# EasyEDA Pro project ProPrj_tl494紫外灯（复活赛）_2025-11-29.epro

# Schematic Schematic1
Board Name: Board1; Create Date: 2025-10-18; Page Name: P1; Project Name: tl494紫外灯（复活赛）; Schematic Name: Schematic1; Update Date: 2025-11-12; Company: 嘉立创EDA; Page Size: A4; Version: V1.0
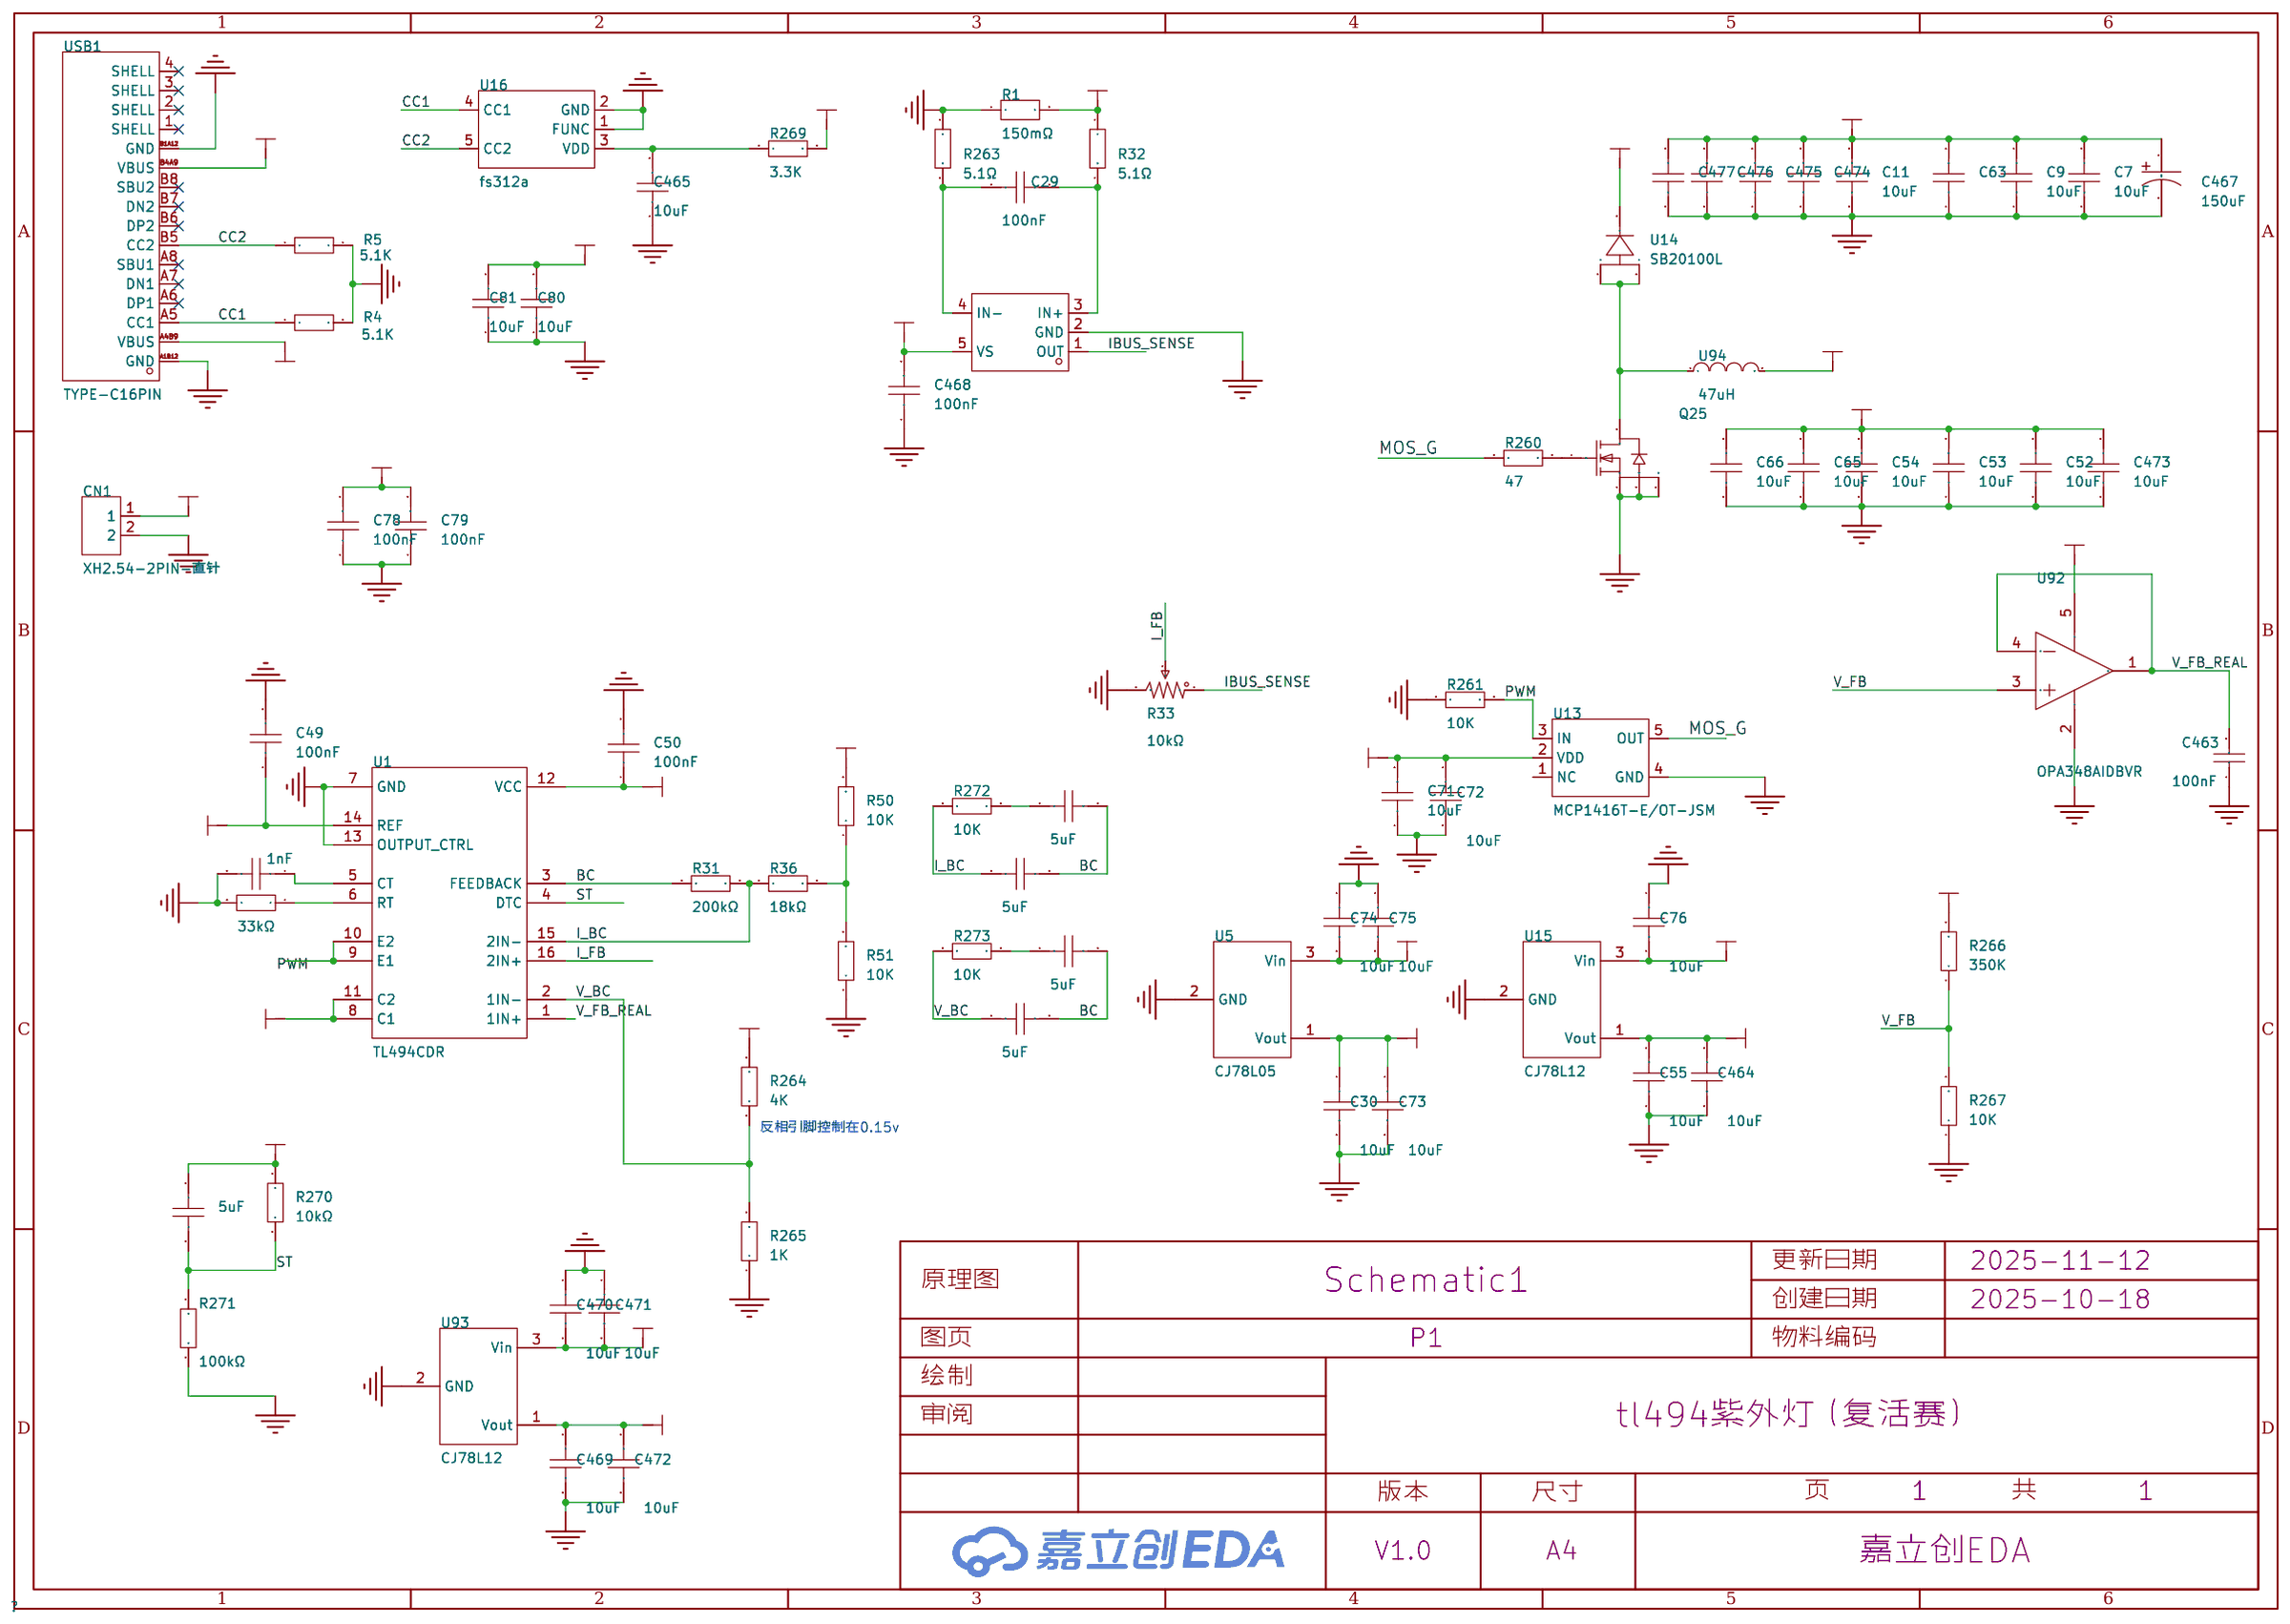
[diagram p0: schematic sheet]

## Parts
C7  10uF  [C1210]
C9  10uF  [C1210]
C11  10uF  [C1210]
C20  1nF  [C0603]
C29  100nF  [C0402_s]
C30  10uF  [C0603]
C49  100nF  [C0603]
C50  100nF  [C0603]
C52  10uF  [C1210]
C53  10uF  [C1210]
C54  10uF  [C1210]
C55  10uF  [C0603]
C63  10uF  [C1210]
C65  10uF  [C1210]
C66  10uF  [C1210]
C70  5uF  [C0603]
C71  10uF  [C0603]
C72  10uF  [C0603]
C73  10uF  [C0603]
C74  10uF  [C0603]
C75  10uF  [C0603]
C76  10uF  [C0603]
C78  100nF  [C0603]
C79  100nF  [C0603]
C80  10uF  [C1210]
C81  10uF  [C1210]
C463  100nF  [C0402_NEW]
C464  10uF  [C0603]
C465  10uF  [C1210]
C467  150uF  [CAP-TH_BD10.0-P5.00-D1.0-FD]
C468  100nF  [C0603]
C469  10uF  [C0603]
C470  10uF  [C0603]
C471  10uF  [C0603]
C472  10uF  [C0603]
C473  10uF  [C1210]
C474  10uF  [C1210]
C475  10uF  [C1210]
C476  10uF  [C1210]
C477  10uF  [C1210]
C478  5uF  [C0603]
C479  5uF  [C0603]
C480  5uF  [C0603]
C481  5uF  [C0603]
CN1  XH2.54-2PIN-直针  [CONN-TH_XH2.54-2P]
Q25  CSD18540Q5B(TOKMAS)  [TDSON-8_L5.9-W5.2-P1.27-BL]
R1  150mΩ  [R2512]
R4  5.1K  [R0603]
R5  5.1K  [R0603]
R23  33kΩ  [R0603]
R31  200kΩ  [R0603]
R32  5.1Ω  [R0603]
R33  10kΩ  [RES-ADJ-TH_3P-L10.0-W10.0-P2.50-L]
R36  18kΩ  [R0603]
R50  10K  [R0603]
R51  10K  [R0603]
R260  47  [R0805]
R261  10K  [R0603]
R263  5.1Ω  [R0603]
R264  4K  [R0603]
R265  1K  [R0603]
R266  350K  [R0603]
R267  10K  [R0603]
R269  3.3K  [R0603]
R270  10kΩ  [R0603]
R271  100kΩ  [R0603]
R272  10K  [R0603]
R273  10K  [R0603]
U1  TL494CDR  [SOIC-16_L9.9-W3.9-P1.27-LS6.0-BL]
U4  null  [SOT-23-5_L3.0-W1.7-P0.95-LS2.8-BR]
U5  CJ78L05  [SOT-89-3_L4.5-W2.5-P1.50-LS4.2-BR]
U13  MCP1416T-E/OT-JSM  [SOT-23-5_L3.0-W1.6-P0.95-LS2.8-BR]
U14  SB20100L  [TO-277_3P-L5.4-W4.0-LS6.5-BR]
U15  CJ78L12  [SOT-89-3_L4.5-W2.5-P1.50-LS4.2-BR]
U16  fs312a  [SOT-23-5_L3.0-W1.7-P0.95-LS2.8-BL]
U92  OPA348AIDBVR  [SOT-23-5_L3.0-W1.7-P0.95-LS2.8-BR]
U93  CJ78L12  [SOT-89-3_L4.5-W2.5-P1.50-LS4.2-BR]
U94  47uH  [IND-TH_L21.5-W10.0_XR065125T]
USB1  TYPE-C16PIN  [USB-C-SMD_TYPE-C16PIN]

## Library data of the parts
C7 C9 C11 C52-C54 C63 C65 C66 C80 C81 C465 C473-C477 = FS32X106K101EGG: 容值:10uF;精度:±10%;额定电压:100V;温度系数:X7R;; LCSC Part Name: 10uF ±10% 100V; Supplier Part: C5156756; Manufacturer: PSA(信昌电陶); Supplier Footprint: 1210; JLCPCB Part Class: 扩展库; Datasheet: https://atta.szlcsc.com/upload/public/pdf/source/20220906/2A42A90825742552985FFB5A7BAB200E.pdf; Supplier: LCSC; Tolerance: ±10%; Voltage Rating: 100V; Temperature Coefficient: X7R
C20 C70 C478-C481 = CAP_0603: Supplier Footprint: 0603
C29 C30 C55 C71-C76 C464 C469-C472 = CL05B104KB54PNC: 容值:100nF;精度:±10%;额定电压:50V;材质(温度系数):X7R;; LCSC Part Name: 100nF ±10% 50V; Supplier Part: C307331; Manufacturer: SAMSUNG(三星); Supplier Footprint: 0402; JLCPCB Part Class: 基础库; Datasheet: https://atta.szlcsc.com/upload/public/pdf/source/20181009/C307331_222F7C870FD3EA5F46F538B483443886.pdf; Supplier: LCSC; Tolerance: ±10%; Voltage Rated: 50V; Temperature Coefficient: X7R
C49 C50 C78 C79 C468 = FM31X224K201EEG: 容值:220nF;精度:±10%;额定电压:200V;材质(温度系数):X7R;; LCSC Part Name: 220nF ±10% 200V; Supplier Part: C2847454; Manufacturer: PSA(信昌电陶); Supplier Footprint: 1206; JLCPCB Part Class: 扩展库; Datasheet: https://atta.szlcsc.com/upload/public/pdf/source/20210721/C2847454_D00BC27086C5022173E0F870A9D97A67.pdf; Supplier: LCSC; Tolerance: ±10%; Voltage Rated: 200V; Temperature Coefficient: X7R
C463 = CL05B104KO5NNNC: 容值:100nF;精度:±10%;额定电压:16V;材质(温度系数):X7R;; LCSC Part Name: 100nF ±10% 16V; Supplier Part: C1525; Manufacturer: SAMSUNG(三星); Supplier Footprint: 0402; JLCPCB Part Class: 基础库; Datasheet: https://atta.szlcsc.com/upload/public/pdf/source/20160103/1457707674891.pdf; Supplier: LCSC; Tolerance: ±10%; Voltage Rated: 16V; Temperature Coefficient: X7R
C467 = LKME2002A151MF: 容值:150uF;精度:±20%;额定电压:100V;纹波电流:-;等效串联电阻(ESR):-;; LCSC Part Name: 150uF ±20% 100V; Supplier Part: C443142; Manufacturer: Ymin(永铭); Supplier Footprint: 插件,D10xL20mm; JLCPCB Part Class: 扩展库; Supplier: LCSC; Tolerance: ±20%; Voltage Rating: 100V; Pin Spacing: 5mm; Diameter: 10mm; Height - Seated (Max): 20mm; Lifetime: 10000hrs@105℃
CN1 = XH2.54-2PIN-直针: Supplier Part: C9900011425; Supplier Footprint: XH2.54-2PIN; JLCPCB Part Class: 扩展库; Supplier: LCSC
Q25 = CSD18540Q5B(TOKMAS): 类型:1个N沟道;漏源电压(Vdss):60V;连续漏极电流(Id):200A;导通电阻(RDS(on)@Vgs,Id):2.3mΩ;功率(Pd):132W;; LCSC Part Name: 1个N沟道 耐压:60V 电流:200A; Supplier Part: C19626234; Manufacturer: Tokmas(托克马斯); Supplier Footprint: DFN-8(5x6); JLCPCB Part Class: 扩展库; Datasheet: https://atta.szlcsc.com/upload/public/pdf/source/20231208/6906E27DFF30F6153115656ACF0DBA8B.pdf; Supplier: LCSC; Type: 1个N沟道; Drain Source Voltage (Vdss): 60V; Continuous Drain Current (Id): 200A; Drain Source On Resistance (RDS(on)@Vgs,Id): 2.3mΩ; Power Dissipation (Pd): 132W
R1 = RE2512F3R150: 电阻类型:采样电阻;阻值:150mΩ;精度:±1%;功率:3W;温度系数:±50ppm/℃;; LCSC Part Name: 150mΩ 3W 2512 ±1%; Supplier Part: C46961761; Manufacturer: 捷而瑞; Supplier Footprint: 2512; JLCPCB Part Class: 扩展库; Datasheet: https://atta.szlcsc.com/upload/public/pdf/source/20250325/401775B85EF7B3A580BC34DFED100CB2.pdf; Supplier: LCSC; Type: 采样电阻; Tolerance: ±1%; Power(Watts): 3W; Temperature Coefficient: ±50ppm/℃
R4 R5 R50 R51 R260 R261 R264-R267 R272 R273 = Res_0603: Supplier Footprint: 0603
R23 R31 R36 R270 R271 = Res_AXIAL-1/8W: Supplier Footprint: 轴向引线
R32 R263 R269 = 0603WAF510KT5E: 电阻类型:厚膜电阻;阻值:5.1Ω;精度:±1%;功率:100mW;; LCSC Part Name: 5.1Ω ±1% 100mW; Supplier Part: C25197; Manufacturer: UNI-ROYAL(厚声); Supplier Footprint: 0603; JLCPCB Part Class: 基础库; Datasheet: https://atta.szlcsc.com/upload/public/pdf/source/20200306/C422600_1E6D84923E4A46A82E41ADD87F860B5C.pdf; Supplier: LCSC; Type: 厚膜电阻; Tolerance: ±1%; Power(Watts): 100mW; Temperature Coefficient: ±200ppm/℃; Overload Voltage (Max): 75V; Operating Temperature Range: -55℃~+155℃
R33 = 3296W-1-103: 阻值:10kΩ;精度:±10%;; LCSC Part Name: 10kΩ ±10%; Supplier Part: C118954; Manufacturer: BOCHEN(博晨); Supplier Footprint: 插件; JLCPCB Part Class: 扩展库; Datasheet: https://atta.szlcsc.com/upload/public/pdf/source/20171114/C118954_15106326646611117443.pdf; Supplier: LCSC; Tolerance: ±10%
U1 = TL494CDR: 功能类型:降压型；升压型；升降压型;输入电压:7V~40V;; Supplier Part: C19882; Manufacturer: TI(德州仪器); Supplier Footprint: SOIC-16-150mil; JLCPCB Part Class: 扩展库; Datasheet: https://www.ti.com/cn/lit/gpn/tl494; Supplier: LCSC; Function: 降压型；升压型；升降压型; Input Voltage: 7V~40V; Switching Frequency: 300kHz; Operating Temperature: 0℃~+70℃@(TA); Synchronous Rectification: 否; Number of Outputs: 2; Topology: 全桥式；降压式；推挽式；正激式；反激式；升压式；半桥式; Switch tube (built-in/external): 外置
U4 = INA180A2IDBVT: 通道数:1;; Supplier Part: C116203; Manufacturer: TI(德州仪器); Supplier Footprint: SOT-23-5; JLCPCB Part Class: 扩展库; Datasheet: https://www.ti.com/cn/lit/gpn/ina180; Supplier: LCSC; Number of Channels: 1; Supply Current: 260uA; Operating Temperature: -40℃~+125℃
U5 U15 U93 = CJ78L05_C2079: 输出类型:固定;工作电压:30V;输出电压:5V;输出电流:100mA;输出极性:正极;; LCSC Part Name: 输入30V 输出5V 100mA; Supplier Part: C2079; Manufacturer: CJ(江苏长电/长晶); Supplier Footprint: SOT-89-3L; JLCPCB Part Class: 扩展库; Datasheet: https://atta.szlcsc.com/upload/public/pdf/source/20171228/C164903_15144413069831213906.pdf; Supplier: LCSC; Output Type: 固定; Voltage - Supply: 30V; Output Voltage: 5V; Output Current: 100mA; Voltage Dropout: 1.7V@(40mA); Output Configuration: 正极; Number of Outputs: 1
U13 = MCP1416T-E/OT-JSM: 驱动配置:-;负载类型:MOSFET；IGBT;驱动通道数:-;灌电流(IOL):2A;拉电流(IOH):2A;工作电压:4.5V~25V;上升时间(tr):-;下降时间(tf):30ns;; LCSC Part Name: 2A单通道高速驱动芯片; Supplier Part: C18195002; Manufacturer: JSMSEMI(杰盛微); Supplier Footprint: SOT-23-5; JLCPCB Part Class: 扩展库; Datasheet: https://item.szlcsc.com/datasheet/MCP1416T-E%252FOT-JSM/19344086.html; Supplier: LCSC; Load Type: MOSFET；IGBT; Current - Output Low(IOL): 2A; Current - Output High(IOH): 2A; Voltage - Supply: 4.5V~25V; Fall Time: 30ns; Features: 欠压保护(UVP); Operating Temperature: -40℃~+125℃
U14 = SB20100L_C5807934: 二极管配置:独立式;正向压降(Vf):700mV@20A;直流反向耐压(Vr):100V;整流电流:20A;; LCSC Part Name: 电压:100V 电流:20A; Supplier Part: C5807934; Manufacturer: GOODWORK(固得沃克); Supplier Footprint: TO-277; JLCPCB Part Class: 扩展库; Datasheet: https://item.szlcsc.com/datasheet/SB20100L/6737143.html; Supplier: LCSC; Diode Configuration: 独立式; Voltage - Forward(Vf@If): 700mV@20A; Voltage - DC Reverse(Vr): 100V; Current - Rectified: 20A; Reverse Leakage Current (Ir): 100uA; Non-Repetitive Peak Forward Surge Current: 200A
U16 = fs312a: Supplier Part: C9900044546; Supplier Footprint: SOT23-5; Supplier: LCSC
U92 = OPA348AIDBVR: 放大器数:单路;轨到轨:-;增益带宽积(GBP):1MHz;压摆率(SR):0.5V/us;输入偏置电流(Ib):0.5pA;; Supplier Part: C363280; Manufacturer: TI(德州仪器); Supplier Footprint: SOT-23-5; JLCPCB Part Class: 扩展库; Datasheet: https://www.ti.com/cn/lit/gpn/opa2348; Supplier: LCSC; Number of Circuits: 单路; Gain Bandwidth Product(GBP): 1MHz; Slew Rate(SR): 0.5V/us; Current - Input Bias(Ib): 0.5pA; Output Current: 10mA; Operating Temperature: -40℃~+125℃
U94 = XR065125TS100MV1L: 电感值:10uH;精度:±10%;额定电流:7.8A;类型:磁环电感;; LCSC Part Name: 带热缩套管; Supplier Part: C22358471; Manufacturer: XR(祥如); Supplier Footprint: 插件,20x9mm; JLCPCB Part Class: 扩展库; Datasheet: https://item.szlcsc.com/datasheet/XR065125TS100MV1L/23794810.html; Supplier: LCSC; Tolerance: ±10%; Current Rating: 7.8A; Type: 磁环电感; Wire Diameter: 1mm
USB1 = TYPE-C16PIN: 连接器类型:Type-C;标准:USB 3.1;公母:母;安装方式:卧贴;触点数量:16P;端口数量:1;额定电流 - 电源:3A;工作温度范围:-40℃~+85℃;; LCSC Part Name: Type-C 母 卧贴; Supplier Part: C393939; Manufacturer: SHOU HAN(首韩); Supplier Footprint: SMD; JLCPCB Part Class: 扩展库; Datasheet: https://atta.szlcsc.com/upload/public/pdf/source/20190521/C393939_7B9043D4CF1026AF443AB60D91FBCD5C.pdf; Supplier: LCSC; Connector Type: Type-C; Standard: USB 3.1; Gender: 母; Mounting Style: 卧贴; Number of Contacts: 16P; Number of Ports: 1; Current Rating - Power (Max): 3A; Operating Temperature Range: -40℃~+85℃; Rated Voltage (Max): 30V; Connect-Disconnect Life: 1万次; Core Colour: 黑色

## Nets
+5V: C30.1 C73.1 C468.2 U4.5(VS) U5.1(Vout) U92.5(V+)
GND: C7.1 C9.1 C11.1 C20.2 C30.2 C49.2 C50.2 C52.1 C53.1 C54.1 C55.2 C63.1 C65.1 C66.1 C71.1 C72.2 C73.2 C74.1 C75.1 C76.1 C78.1 C79.1 C80.1 C81.1 C463.1 C464.2 C465.1 C467.2 C468.1 C469.2 C470.1 C471.1 C472.2 C473.1 C474.1 C475.1 C476.1 C477.1 CN1.2 Q25.1(S) Q25.2(S) Q25.3(S) R1.1 R4.2 R5.2 R23.2 R33.3 R51.1 R261.1 R263.1 R265.1 R267.1 R271.2 U1.7(GND) U1.13(OUTPUT CTRL) U4.2(GND) U5.2(GND) U13.4(GND) U15.2(GND) U16.1(FUNC) U16.2(GND) U92.2(V-) U93.2(GND) USB1.A1B12(GND) USB1.B1A12(GND)
GND_LED: R1.2 R32.1
VCC_12V: C55.1 C71.2 C72.1 C464.1 U13.2(VDD) U15.1(Vout)
VCC_12V_0: C78.2 C79.2 C469.1 C472.1 CN1.1 U93.1(Vout)
VCC_20V: C50.1 C52.2 C53.2 C54.2 C65.2 C66.2 C74.2 C75.2 C76.2 C80.2 C81.2 C470.2 C471.2 C473.2 R269.2 U1.12(VCC) U5.3(Vin) U15.3(Vin) U93.3(Vin) U94.2 USB1.A4B9(VBUS) USB1.B4A9(VBUS)
VCC_LED: C7.2 C9.2 C11.2 C63.2 C467.1 C474.2 C475.2 C476.2 C477.2 R266.2 U14.2(A)
BC: C478.2 C479.2 C480.2 C481.2 R31.1 U1.3(FEEDBACK)
CC1: R4.1 U16.4(CC1) USB1.A5(CC1)
CC2: R5.1 U16.5(CC2) USB1.B5(CC2)
I_BC: C478.1 R31.2 R36.1 R272.2 U1.15(2IN-)
I_FB: R33.2 U1.16(2IN+)
IBUS_SENSE: R33.1 U4.1(OUT)
MOS_G: R260.1 U13.5(OUT)
PWM: R261.2 U1.9(E1) U1.10(E2) U13.3(IN)
REF_5V: C49.1 C70.1 R50.2 R264.2 R270.1 U1.8(C1) U1.11(C2) U1.14(REF)
ST: C70.2 R270.2 R271.1 U1.4(DTC)
V_BC: C480.1 R264.1 R265.2 R273.2 U1.2(1IN-)
V_FB: R266.1 R267.2 U92.3(IN+)
V_FB_REAL: C463.2 U1.1(1IN+) U92.1(OUT) U92.4(IN-)
$1N2212: R36.2 R50.1 R51.2
$1N2215: R23.1 U1.6(RT)
$1N2218: C20.1 U1.5(CT)
$1N2952: Q25.4(G) R260.2
$1N3019: Q25.5(D) U14.1(K) U14.3(K) U94.1
$1N3862: C29.2 R32.2 U4.3(IN+)
$1N3872: C29.1 R263.2 U4.4(IN-)
$1N4683: C465.2 R269.1 U16.3(VDD)
$1N15446: C479.1 R272.1
$1N15548: C481.1 R273.1

Not connected (* = marked no-connect by the designer): U13 1(NC); USB1 1(SHELL)* 2(SHELL)* 3(SHELL)* 4(SHELL)* A6(DP1)* A7(DN1)* A8(SBU1)* B6(DP2)* B7(DN2)* B8(SBU2)*

## Notes on the sheet
- 反相引脚控制在0.15v

# Board PCB1
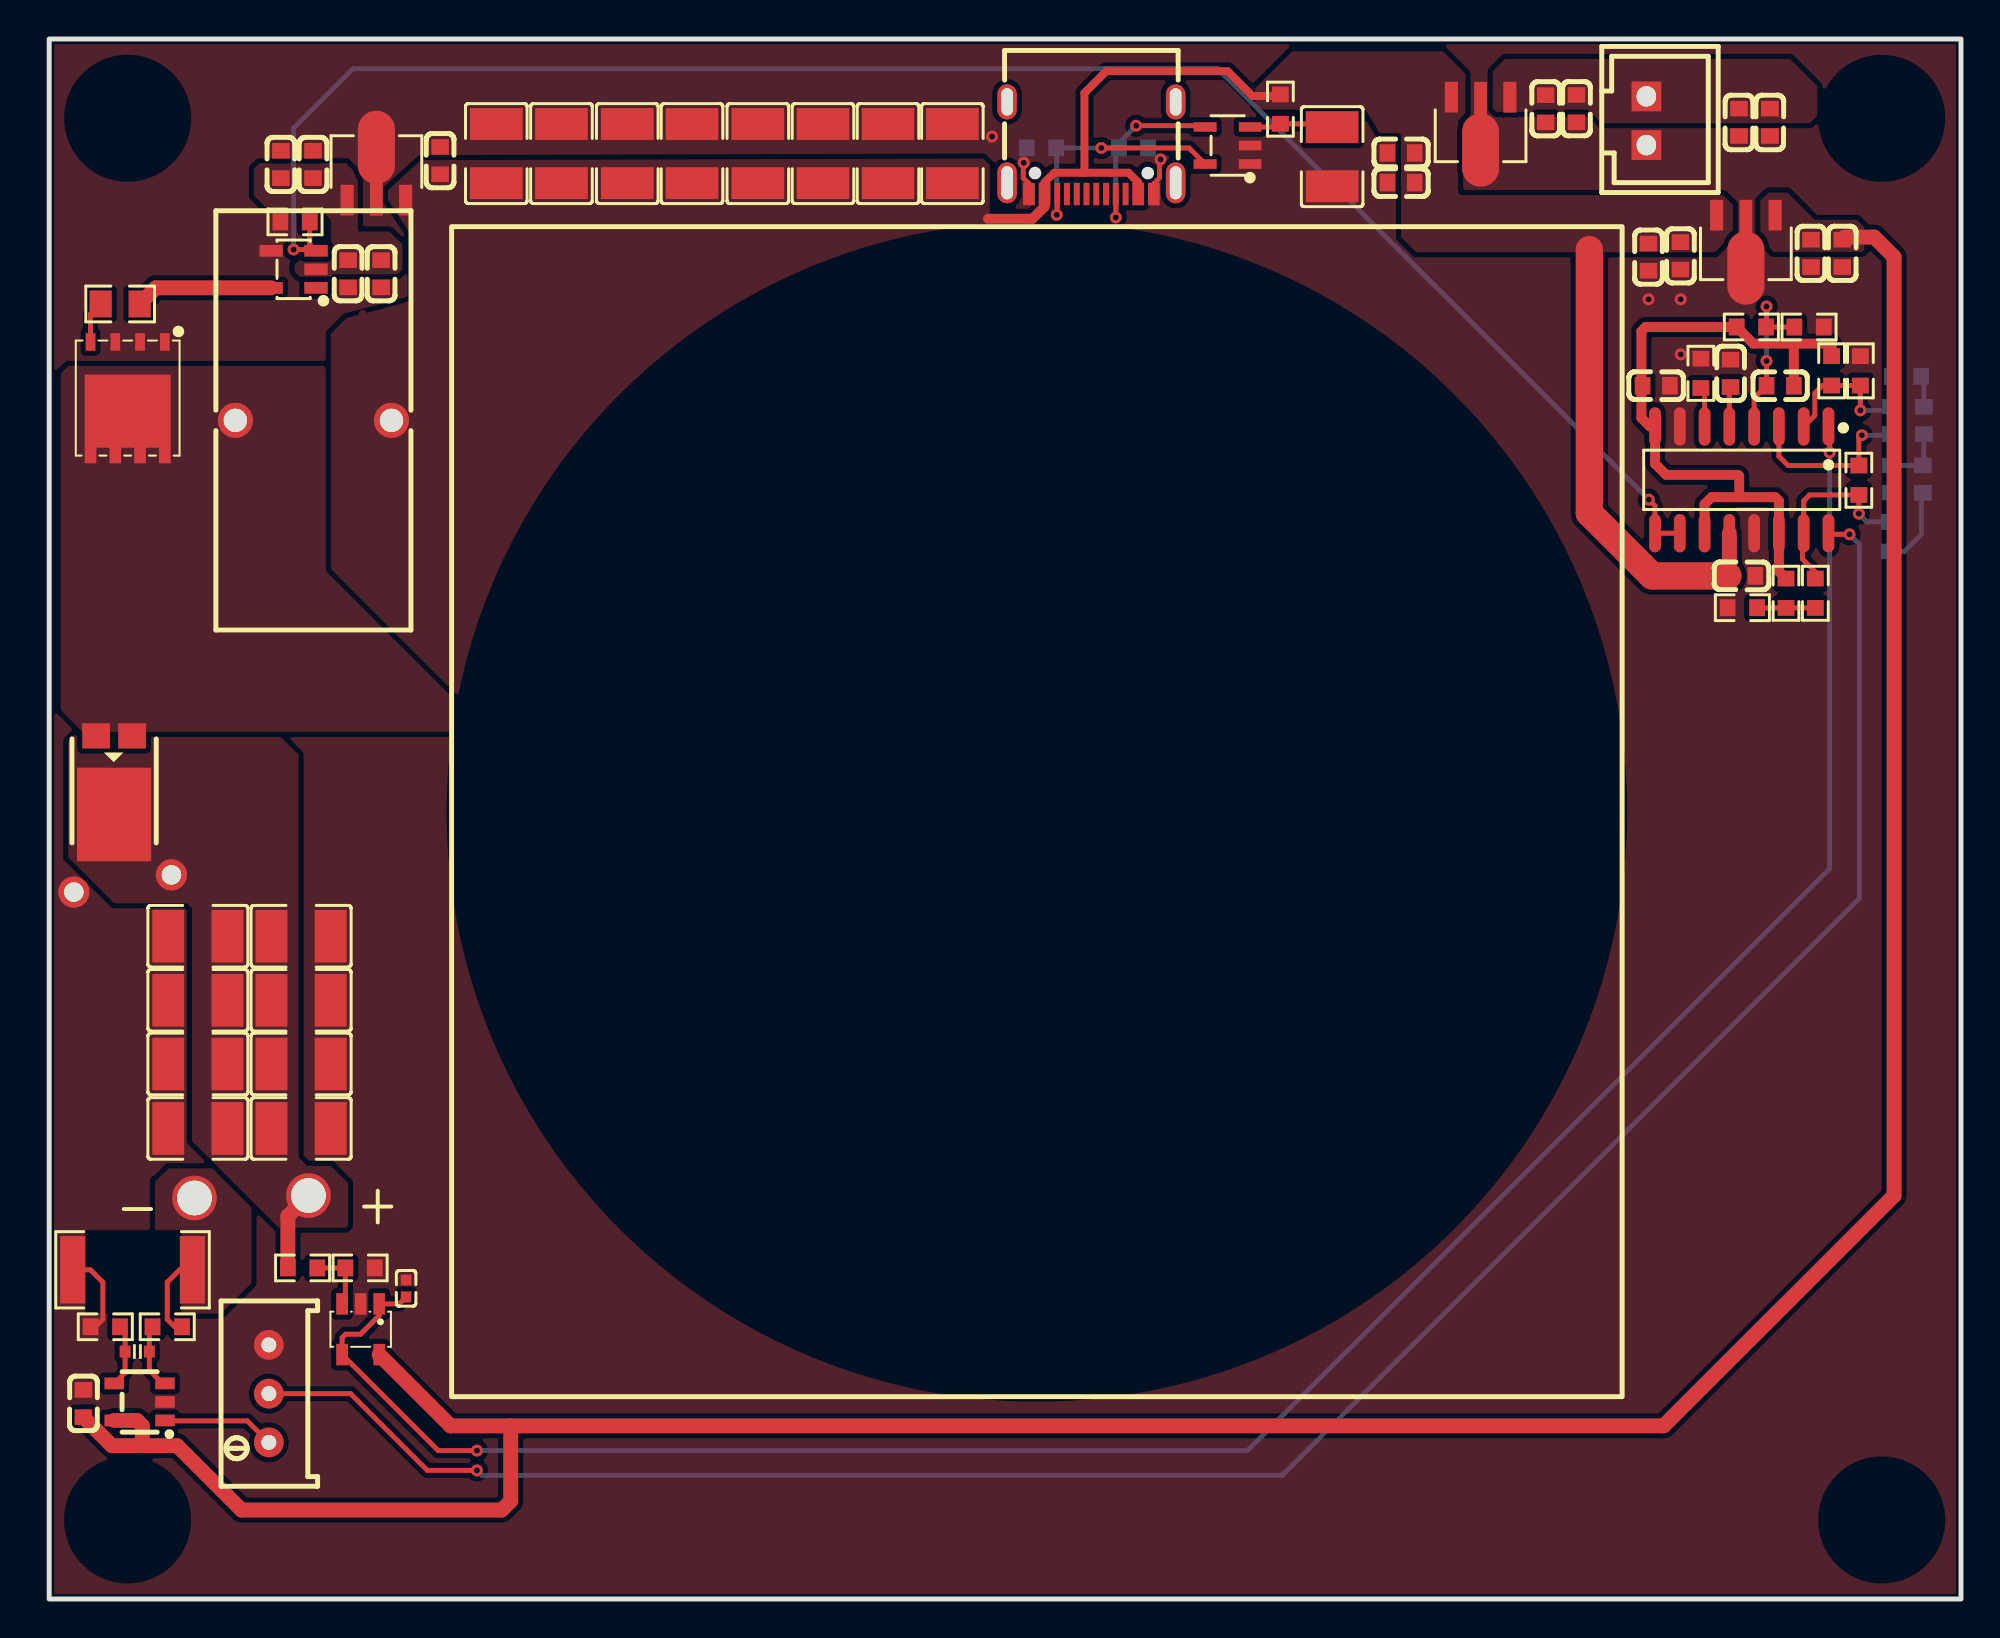
[diagram p1: board, top side]
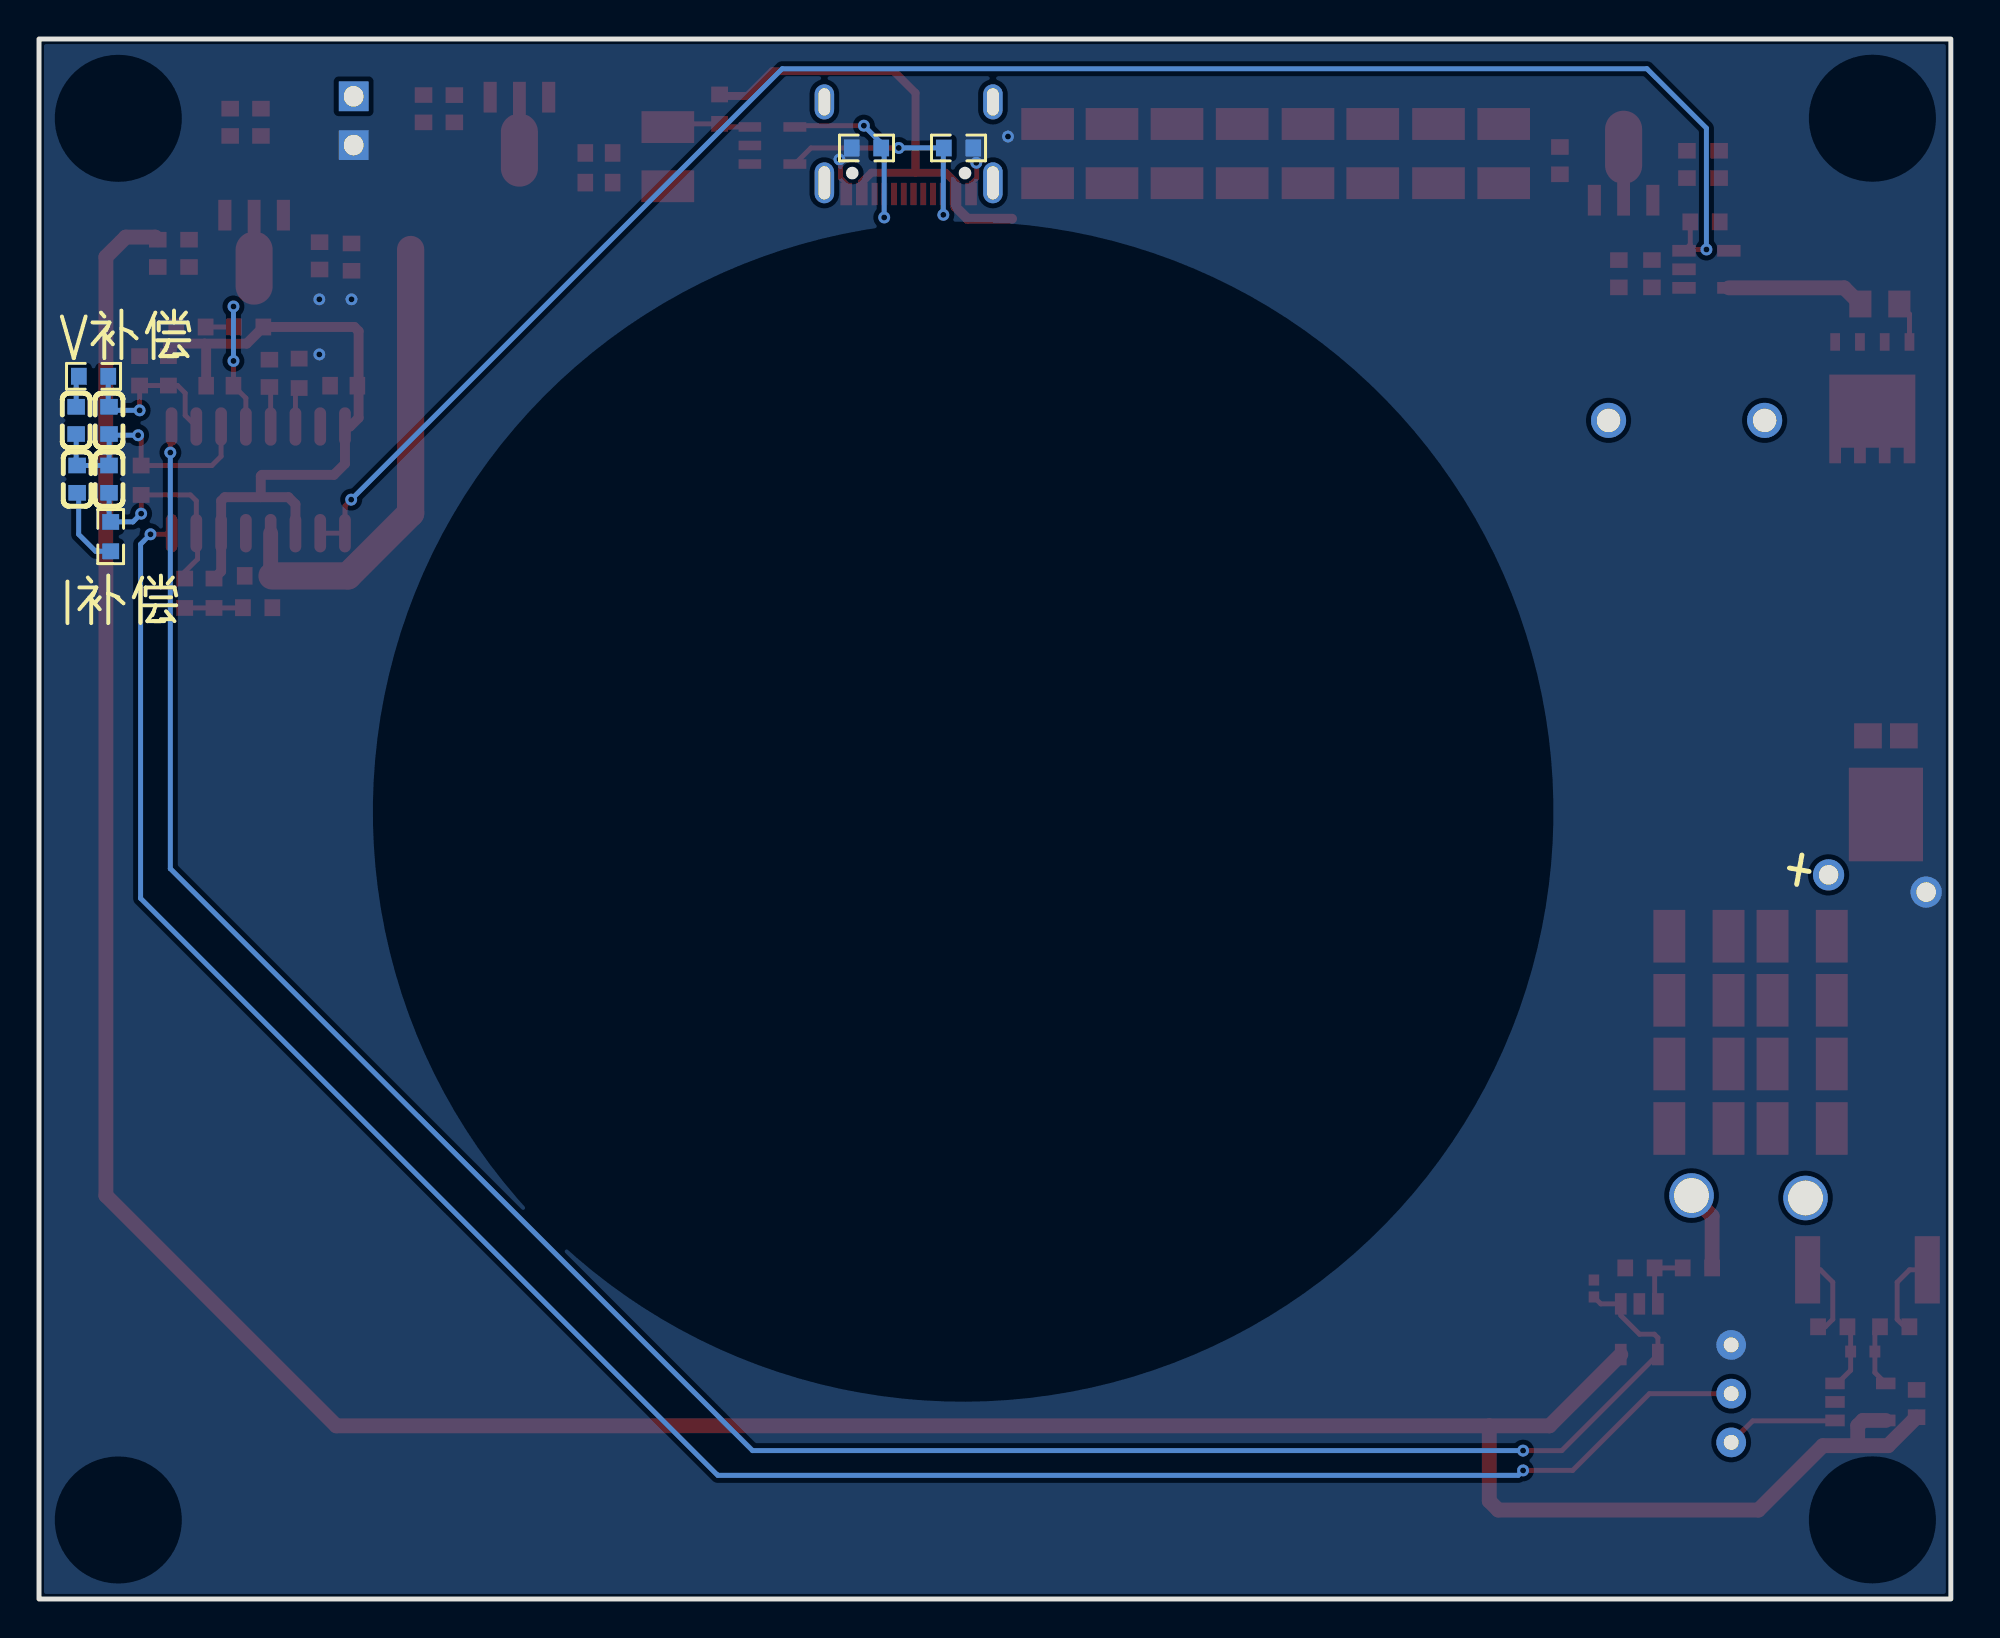
[diagram p2: board, bottom side, seen from below]

Outline 98 x 80 mm; copper layers: Top Layer, Inner1, Inner2, Bottom Layer. Coordinates in mm from the lower left corner of the outline.
Outline path: rectangle 0,80 98,0
Stack: Top Layer 0.035mm 外层铜厚1oz / Dielectric1 0.2104mm 7628 RC49% 8.6mil / Inner1 0.0152mm 内层铜厚 / Dielectric2 1.065mm 1.1mm H/HOZ Copper / Inner2 0.0152mm 内层铜厚 / Dielectric3 0.2104mm 7628 RC49% 8.6mil / Bottom Layer 0.035mm 外层铜厚1oz

## Design rules (mm)
template: 自定义配置
spacing copperThickness1oz (default): track to track 0.102, other pairs 0.152 to 0.3
spacing copperThickness2oz: track to track 0.203, other pairs 0.152 to 0.3
track width copperThickness1oz (default): min 0.127, default 0.254, max 2.54
track width copperThickness2oz: min 0.203, default 0.254, max 2.54
differential pair differentialPair (default): width min 0.127, default 0.254, max 2.54; gap min 0.152, default 0.152
via viaSize (default): diameter min 0.5, default 0.61, max 10; hole min 0.3, default 0.305, max 6.3

## Placement (name value [footprint] x y rotation side)
C7  10uF  [C1210]  7.62 24.13 0 top
C9  10uF  [C1210]  7.62 27.44 0 top
C11  10uF  [C1210]  7.62 33.99 0 top
C20  1nF  [C0603]  86.19 62.85 90 top
C29  100nF  [C0402_s]  4.53 12.69 180 top
C30  10uF  [C0603]  90.31 69.01 270 top
C49  100nF  [C0603]  82.38 62.22 0 top
C50  100nF  [C0603]  86.76 52.47 0 top
C52  10uF  [C1210]  22.92 74.12 270 top
C53  10uF  [C1210]  26.26 74.12 270 top
C54  10uF  [C1210]  29.63 74.12 270 top
C55  10uF  [C0603]  11.88 73.57 90 top
C63  10uF  [C1210]  7.62 30.7 0 top
C65  10uF  [C1210]  36.33 74.12 270 top
C66  10uF  [C1210]  32.95 74.12 270 top
C70  5uF  [C0603]  88.73 62.22 180 top
C71  10uF  [C0603]  17.02 67.96 90 top
C72  10uF  [C0603]  15.32 67.96 270 top
C73  10uF  [C0603]  91.91 69.01 270 top
C74  10uF  [C0603]  83.62 68.88 90 top
C75  10uF  [C0603]  81.98 68.82 90 top
C76  10uF  [C0603]  20.04 73.76 270 top
C78  100nF  [C0603]  88.2 75.73 90 top
C79  100nF  [C0603]  86.62 75.73 90 top
C80  10uF  [C1210]  46.3 74.12 270 top
C81  10uF  [C1210]  43 74.12 270 top
C463  100nF  [C0402_NEW]  18.3 15.93 270 top
C464  10uF  [C0603]  13.52 73.57 90 top
C465  10uF  [C1210]  65.77 73.96 90 top
C467  150uF  [CAP-TH_BD10.0-P5.00-D1.0-FD]  3.77 36.69 190 bottom
C468  100nF  [C0603]  1.75 10.02 270 top
C469  10uF  [C0603]  78.29 76.43 270 top
C470  10uF  [C0603]  69.3 72.63 0 top
C471  10uF  [C0603]  69.3 74.16 0 top
C472  10uF  [C0603]  76.71 76.42 270 top
C473  10uF  [C1210]  39.67 74.12 270 top
C474  10uF  [C1210]  12.91 33.99 180 top
C475  10uF  [C1210]  12.91 30.7 180 top
C476  10uF  [C1210]  12.91 27.44 180 top
C477  10uF  [C1210]  12.91 24.13 180 top
C478  5uF  [C0603]  94.41 57.43 90 bottom
C479  5uF  [C0603]  96.04 57.43 90 bottom
C480  5uF  [C0603]  94.41 60.44 270 bottom
C481  5uF  [C0603]  96.09 60.44 270 bottom
CN1  XH2.54-2PIN-直针  [CONN-TH_XH2.54-2P]  81.87 75.81 270 top
NOREF  -  [Pad_e385]  7.45 20.56 0 top
NOREF#2  -  [Pad_e384]  13.29 20.69 0 top
Q25  CSD18540Q5B(TOKMAS)  [TDSON-8_L5.9-W5.2-P1.27-BL]  4.02 62.69 180 top
R1  150mΩ  [R2512]  4.27 16.88 0 top
R4  5.1K  [R0603]  55.58 74.41 0 bottom
R5  5.1K  [R0603]  50.87 74.41 180 bottom
R23  33kΩ  [R0603]  84.67 62.85 90 top
R31  200kΩ  [R0603]  92.76 57.37 270 top
R32  5.1Ω  [R0603]  6.05 13.96 180 top
R33  10kΩ  [RES-ADJ-TH_3P-L10.0-W10.0-P2.50-L]  11.26 10.53 90 top
R36  18kΩ  [R0603]  90.53 51.58 270 top
R50  10K  [R0603]  89.03 51.58 90 top
R51  10K  [R0603]  86.79 50.84 0 top
R260  47  [R0805]  3.64 66.41 180 top
R261  10K  [R0603]  12.6 70.62 0 top
R263  5.1Ω  [R0603]  2.88 13.96 0 top
R264  4K  [R0603]  91.37 62.98 90 top
R265  1K  [R0603]  92.84 62.98 270 top
R266  350K  [R0603]  12.99 16.98 180 top
R267  10K  [R0603]  15.94 16.98 180 top
R269  3.3K  [R0603]  63.11 76.4 90 top
R270  10kΩ  [R0603]  87.25 65.23 0 top
R271  100kΩ  [R0603]  90.21 65.23 0 top
R272  10K  [R0603]  94.33 54.48 90 bottom
R273  10K  [R0603]  95.2 62.7 180 bottom
U1  TL494CDR  [SOIC-16_L9.9-W3.9-P1.27-LS6.0-BL]  86.76 57.39 180 top
U4  null  [SOT-23-5_L3.0-W1.7-P0.95-LS2.8-BR#2]  4.64 10.11 0 top
U5  CJ78L05  [SOT-89-3_L4.5-W2.5-P1.50-LS4.2-BR]  86.97 69.61 90 top
U13  MCP1416T-E/OT-JSM  [SOT-23-5_L3.0-W1.6-P0.95-LS2.8-BR]  12.53 68.19 0 top
U14  SB20100L  [TO-277_3P-L5.4-W4.0-LS6.5-BR]  3.33 42.25 90 top
U15  CJ78L12  [SOT-89-3_L4.5-W2.5-P1.50-LS4.2-BR]  16.77 73.09 270 top
U16  fs312a  [SOT-23-5_L3.0-W1.7-P0.95-LS2.8-BL]  60.41 74.54 90 top
U92  OPA348AIDBVR  [SOT-23-5_L3.0-W1.7-P0.95-LS2.8-BR]  15.97 13.83 90 top
U93  CJ78L12  [SOT-89-3_L4.5-W2.5-P1.50-LS4.2-BR]  73.37 75.66 90 top
U94  47uH  [IND-TH_L21.5-W10.0_XR065125T]  13.55 60.44 0 top
USB1  TYPE-C16PIN  [USB-C-SMD_TYPE-C16PIN]  53.42 74.41 180 top

## Footprints (pads in the part's own frame, mm; a bottom-side part is the same pattern mirrored in y, then rotated)
C0402_NEW
  rect 0.566x0.54 smd: 1(-0.425,0) 2(0.441,0)
C0402_s
  rect 0.559x0.61 smd: 1(0.635,0) 2(-0.61,0)
C0603
  rect 0.8x0.9 smd: 1(-0.7,0) 2(0.7,0)
C1210
  rect 1.635x2.7 smd: 1(-1.518,0) 2(1.518,0)
CAP-TH_BD10.0-P5.00-D1.0-FD
  round 1.6 hole 1: 1(-2.54,0) 2(2.54,0)
CONN-TH_XH2.54-2P
  rect 1.524x1.524 hole 1.05x1: 1(-1.25,0) 2(1.25,0)
IND-TH_L21.5-W10.0_XR065125T
  round 1.8 hole 1.2: 1(-4,0) 2(4,0)
Pad_e384
  round 2.286 hole 1.778: 2(0,0)
Pad_e385
  round 2.286 hole 1.778: 1(0,0)
R0603
  rect 0.806x0.864 smd: 1(-0.753,0) 2(0.753,0)
R0805
  rect 1.133x1.377 smd: 1(-1,0) 2(1,0)
R2512
  rect 1.282x3.456 smd: 1(-3.067,0) 2(3.067,0)
RES-ADJ-TH_3P-L10.0-W10.0-P2.50-L
  round 1.524 hole 0.762: 1(-2.5,0) 2(0,0) 3(2.5,0)
SOIC-16_L9.9-W3.9-P1.27-LS6.0-BL
  oval 0.602x1.971 smd: 1(-4.445,-2.736) 2(-3.175,-2.736) 3(-1.905,-2.736) 4(-0.635,-2.736) 5(0.635,-2.736) 6(1.905,-2.736) 7(3.175,-2.736) 8(4.445,-2.736) 9(4.445,2.736) 10(3.175,2.736) 11(1.905,2.736) 12(0.635,2.736) 13(-0.635,2.736) 14(-1.905,2.736) 15(-3.175,2.736) 16(-4.445,2.736)
SOT-23-5_L3.0-W1.6-P0.95-LS2.8-BR
  rect 1.2x0.6 smd: 1(1.15,-0.95) 2(1.15,0) 3(1.15,0.95) 4(-1.15,0.95) 5(-1.15,-0.95)
SOT-23-5_L3.0-W1.7-P0.95-LS2.8-BL
  rect 0.49x1.157 smd: 1(-0.95,-1.153) 2(0,-1.153) 3(0.95,-1.153)
  rect 0.49x1.175 smd: 4(0.95,1.153) 5(-0.95,1.153)
SOT-23-5_L3.0-W1.7-P0.95-LS2.8-BR
  rect 1.1x0.6 smd: 1(1.3,-0.95) 2(1.3,0) 3(1.3,0.95) 4(-1.3,0.95) 5(-1.3,-0.95)
SOT-23-5_L3.0-W1.7-P0.95-LS2.8-BR#2
  rect 1x0.6 smd: 1(1.3,-0.95) 2(1.3,0) 3(1.3,0.95) 4(-1.3,0.95) 5(-1.3,-0.95)
SOT-89-3_L4.5-W2.5-P1.50-LS4.2-BR
  rect 1.575x0.672 smd: 1(1.356,-1.5) 3(1.356,1.5)
  custom 5.377x1.9 smd: 2(-1.356,0)
TDSON-8_L5.9-W5.2-P1.27-BL
  rect 0.5x0.9 smd: 1(-1.905,-1.775) 2(-0.635,-1.775) 3(0.635,-1.775) 4(1.905,-1.775)
  custom 4.41x4.55 smd: 5(0,1.775)
TO-277_3P-L5.4-W4.0-LS6.5-BR
  rect 1.29x1.423 smd: 1(2.017,-0.92) 3(2.017,0.92)
  rect 4.8x3.8 smd: 2(-2.017,0)
USB-C-SMD_TYPE-C16PIN
  oval 1x2.1 hole 0.6x1.7: 1(-4.32,1.788) 2(4.32,1.788)
  oval 1x1.8 hole 0.6x1.4: 3(-4.32,-2.362) 4(4.32,-2.362)
  rect 0.6x1.15 smd: A1B12(-3.2,2.362) A4B9(-2.4,2.362) B1A12(3.2,2.362) B4A9(2.4,2.362)
  rect 0.3x1.15 smd: A5(-1.25,2.362) A6(-0.25,2.362) A7(0.25,2.362) A8(1.25,2.362) B5(1.75,2.362) B6(0.75,2.362) B7(-0.75,2.362) B8(-1.75,2.362)

## Nets
As in the schematic, except:
GND_LED: NOREF.1 R1.2 R32.1
VCC_LED: C7.2 C9.2 C11.2 C63.2 C467.1 C474.2 C475.2 C476.2 C477.2 NOREF#2.2 R266.2 U14.2

Pads without a net: U13 1; USB1 1 2 3 4 A6 A7 A8 B6 B7 B8

## Via types
v1: diameter 0.61, hole 0.305, Top Layer to Bottom Layer, 21 vias

## Routing (per net, layer and track width the routed paths; a pad name or vN(x,y) marks a point on that pad's centre or on a via; arc(x,y) is an arc through that point)
+5V: length 165.8
  Top Layer w0.762: C73.1 92.05,69.84 93.55,69.84 94.57,68.82 94.57,20.69 82.76,8.88 23.66,8.88 ; 16.92,12.53 20.57,8.88 23.66,8.88 ; U4.5 4.51,9.16 4.77,8.89 4.77,7.86 ; 23.66,8.88 23.66,5.02 23.2,4.56 9.86,4.56 6.56,7.86 4.77,7.86 ; 4.77,7.86 3.22,7.86 1.75,9.32
GND: length 8.2
  Top Layer w0.254: R1.1 2.11,16.88 2.75,16.25 2.75,14.34 2.37,13.96 R263.1 ; v1(56.97,73.83) 56.92,73.78 56.92,72.87 56.62,72.58 56.62,72.05 ; USB1.B1A12 50.22,72.58 49.93,72.87 49.93,73.62 v1(49.96,73.65)
  vias: v1(48.33,75) v1(81.98,66.65) v1(83.63,66.65) v1(83.63,63.82)
GND_LED: length 4.4
  Top Layer w0.254: R1.2 6.69,16.88 6.05,16.25 6.05,14.34 6.43,13.96 R32.1
VCC_20V: length 49.3
  Top Layer w0.406: 53.07,73.14 51.52,73.14 51.02,72.65 USB1.B4A9 ; 53.07,73.14 55.33,73.14 55.82,72.65 USB1.A4B9 ; 53.07,73.14 53.07,77.23 54.18,78.35 60.41,78.35 61.68,77.08 63.04,77.08 R269.2
  Top Layer w0.508: 48.12,70.78 50.4,70.78 51.02,71.4 USB1.B4A9
  Top Layer w0.762: 86.06,52.69 86.13,52.76 U1.12
  Top Layer w1.397: 78.95,69.2 78.95,55.68 82.17,52.47 C50.1
VCC_LED: length 4.1
  Top Layer w0.762: NOREF#2.2 12.24,19.64 R266.2
BC: length 13.8
  Top Layer w0.254: U1.3 88.67,58.6 89.14,58.13 R31.1 92.76,59.52 v1(92.92,59.68)
  Bottom Layer w0.254: C481.2 96.09,58.18 C479.2 C478.2 C480.2 94.35,59.68 v1(92.92,59.68)
CC1: length 9.9
  Top Layer w0.254: v1(54.68,70.85) 54.68,72.05 USB1.A5 ; U16.4 59.19,75.55 v1(55.72,75.55)
  Bottom Layer w0.254: v1(54.68,70.85) 54.68,74.26 R4.1 54.83,74.67 v1(55.72,75.55)
CC2: length 12.5
  Top Layer w0.254: USB1.B5 51.67,71.01 v1(51.64,70.98) ; v1(53.93,74.41) 58.43,74.41 U16.5
  Bottom Layer w0.254: v1(53.93,74.41) 51.67,74.41 51.64,74.39 ; 51.64,74.39 R5.1 ; 51.64,74.39 v1(51.64,70.98)
I_BC: length 11.5
  Top Layer w0.254: v1(92.76,55.66) R31.2 90.24,56.62 89.94,56.31 U1.15 89.87,54.59 89.87,53.33 90.53,52.67 R36.1
  Bottom Layer w0.254: v1(92.76,55.66) 93.19,55.23 R272.2 94.41,55.32 C478.1
I_FB: length 115.5
  Top Layer w0.254: R33.2 15.45,10.53 19.39,6.59 v1(21.93,6.59) ; U1.16 91.26,54.6 v1(92.28,54.6)
  Bottom Layer w0.254: v1(92.28,54.6) 92.79,54.09 92.79,35.93 63.2,6.34 22.18,6.34 v1(21.93,6.59)
IBUS_SENSE: length 5.8
  Top Layer w0.254: U4.1 5.96,9.13 10.16,9.13 R33.1
MOS_G: length 7.1
  Top Layer w0.762: U13.5 5.47,67.24 R260.1
PWM: length 91.9
  Top Layer w0.254: 13.61,69.2 U13.3 ; 13.61,69.2 13.36,69.46 R261.2 ; 13.61,69.2 v1(12.53,69.2) ; U1.10 U1.9 82.32,56.06 v1(82,56.38)
  Bottom Layer w0.254: v1(82,56.38) 59.9,78.48 15.58,78.48 12.53,75.43 v1(12.53,69.2)
REF_5V: length 35.6
  Top Layer w0.508: 86.63,56.5 85.22,56.5 84.86,56.15 U1.11 ; 86.63,56.5 88.48,56.5 88.67,56.31 U1.14 88.67,52.69 R50.2 ; 86.63,56.5 86.63,57.59 86.57,57.65 82.89,57.65 82.32,58.22 U1.8 82.06,60.13 81.62,60.57 81.62,62.16 C49.1 81.62,62.28 81.62,65.01 81.83,65.23 R270.1 87.35,64.38 89.51,64.38 ; 89.51,64.38 89.43,64.3 C70.1 ; 89.51,64.38 91.37,64.38 91.37,63.74
ST: length 8.9
  Top Layer w0.254: U1.4 87.4,61.58 C70.2 v1(88.03,63.49) ; v1(88.03,66.28) 88.03,65.26 88.01,65.23 89.46,65.23 R271.1
  Bottom Layer w0.254: v1(88.03,63.49) v1(88.03,66.28)
V_BC: length 8.9
  Top Layer w0.254: U1.2 90.51,60.7 90.51,61.84 90.9,62.23 R264.1 R265.2 v1(92.84,60.96)
  Bottom Layer w0.254: v1(92.84,60.96) 94.22,60.96 C480.1 94.45,61.18 94.45,62.7
V_FB: length 3.4
  Top Layer w0.254: U92.3 15.18,15.3 R267.2 R266.1
V_FB_REAL: length 118.7
  Top Layer w0.254: v1(21.93,7.61) 19.94,7.61 U92.4 ; v1(91.27,58.79) 91.27,60.07 U1.1 ; 15.02,12.54 15.02,13.4 15.2,13.58 15.96,13.58 16.92,14.54 16.92,15.13 17.94,15.13 C463.2
  Bottom Layer w0.254: v1(91.27,58.79) 91.27,37.45 61.42,7.61 v1(21.93,7.61)
$1N2212: length 3
  Top Layer w0.254: R51.2 87.56,50.82 R50.1 R36.2
$1N2215: length 2.1
  Top Layer w0.254: R23.1 84.86,61.91 U1.6
$1N2218: length 2.1
  Top Layer w0.254: U1.5 86.13,62.09 C20.1
$1N2952: length 2.2
  Top Layer w0.254: R260.2 2.12,65.89 Q25.4
$1N3862: length 3.4
  Top Layer w0.254: U4.3 5.81,11.06 5.14,11.73 C29.2 5.14,13.8 R32.2
$1N3872: length 3.2
  Top Layer w0.254: R263.2 3.89,13.7 C29.1 3.89,11.61 U4.4
$1N4683: length 4.3
  Top Layer w0.254: U16.3 62.95,75.49 63.11,75.65 65.6,75.65 C465.2
$1N15446: length 4.2
  Bottom Layer w0.254: 94.33,53.73 95.1,53.73 95.97,54.6 95.97,56.65 C479.1
$1N15548: length 1.6
  Bottom Layer w0.254: R273.1 96.09,62.57 C481.1

## Copper pours and planes (outline as drawn; the poured copper is in the pictures)
+5V on Top Layer: 88.12,72.13 89.11,72.13 90.51,70.73 92.67,70.73 93.05,70.35 93.05,69.2 92.92,69.08 88.39,69.08 87.71,69.75 87.71,71.72
GND on Top Layer: 0,80 98,80 98,0 0,0
GND on Bottom Layer: 0,80 98,80 98,0 0,0
GND on Inner1: 0,80 98,80 98,0 0,0
GND on Inner2: 0,80 98,80 98,0 0,0
GND_LED on Top Layer: 6.12,22.09 8.59,22.09 10.37,20.31 10.37,16.19 8.81,14.63 6.78,14.63 5.42,15.99 5.42,21.45 5.48,21.45
VCC_12V on Top Layer: 10.77,73.63 15.21,73.63 15.83,73.01 15.83,70.13 17.45,70.13 18.12,69.46 18.12,68.19 17.86,67.93 14.56,67.93 14.43,67.81 12.84,67.81 12.57,68.08 12.57,68.41 12.86,68.7 14.18,68.7 14.43,68.95 14.43,70.73 13.88,71.28 11.17,71.28 10.5,71.96 10.5,73.36
VCC_12V_0 on Top Layer: 74,78.35 74.63,78.98 89.24,78.98 90.63,77.59 90.63,76.06 90.25,75.68 79.58,75.68 79,76.26 74.18,76.26 74,76.44
VCC_20V on Top Layer: 63.71,79.36 71.46,79.36 72.6,78.22 72.6,76.19 72.22,75.81 72.22,72.13 72.35,72 85.81,72 86.32,71.49 86.32,70 85.38,69.07 70.07,69.07 69.3,69.84 69.3,75.05 69.17,75.17 68.2,75.17 67.48,76.38 62,76.38 61.8,76.57 61.8,77.46
VCC_20V on Top Layer: 15.24,65.7 16.07,65.9 18.62,66.59 18.62,69.84 17.35,71.74 17.35,72.24 19.05,73.79 47.87,73.87 48.22,73.53 48.22,68.1 21.91,45.34 14.43,52.82 14.43,64.89
VCC_LED on Top Layer: 1.3,44.31 11.77,44.31 12.78,43.3 12.78,22.65 13.22,22.21 14.43,22.21 15.32,21.33 15.32,19.17 15.2,19.04 11.77,19.04 7.32,23.48 7.32,35.42 7.07,35.68 3.34,35.68 0.97,38.04 0.97,43.99
$1N3019 on Top Layer: 0.97,63.24 14.05,63.24 14.31,62.98 14.31,58.28 15.83,56.76 20.21,56.76 20.63,56.34 20.63,44.47 1.71,44.47 0.59,45.58 0.59,62.85

## Text on the board
Bottom Silkscreen Layer: I补偿 | V补偿
Top Silkscreen Layer: - | +
